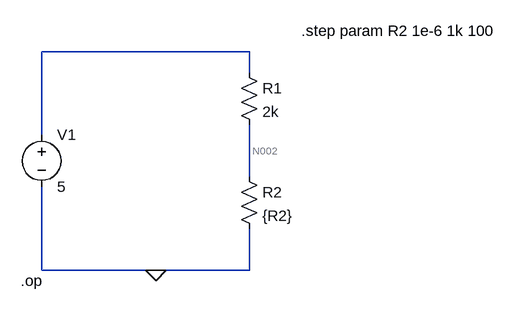
[diagram p0: schematic Draft2.asc]
Draft2.asc, the LTspice schematic file:
Version 4
SHEET 1 880 680
WIRE 320 -352 0 -352
WIRE 320 -320 320 -352
WIRE 0 -224 0 -352
WIRE 320 -160 320 -240
WIRE 0 -16 0 -144
WIRE 176 -16 0 -16
WIRE 320 -16 320 -80
WIRE 320 -16 176 -16
FLAG 176 -16 0
SYMBOL res 304 -336 R0
SYMATTR InstName R1
SYMATTR Value 2k
SYMBOL voltage 0 -240 R0
WINDOW 123 0 0 Left 0
WINDOW 39 0 0 Left 0
SYMATTR InstName V1
SYMATTR Value 5
SYMBOL res 304 -176 R0
SYMATTR InstName R2
SYMATTR Value {R2}
TEXT 400 -384 Left 2 !.step param R2 1e-6 1k 100
TEXT -32 0 Left 2 !.op

The netlist it stands for:
* Draft2.asc
R1 N001 N002 2k
V1 N001 0 5
R2 N002 0 {R2}
.step param R2 1e-6 1k 100
.op
.backanno
.end

* Results of the author's LTspice run, read from the files saved beside the schematic
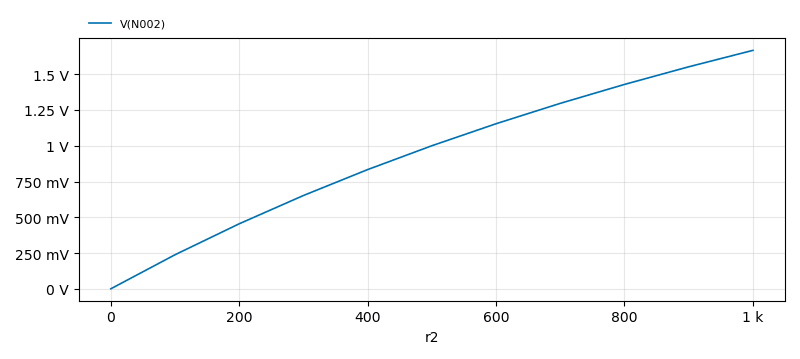
[diagram p1: Operating Point of Draft2.asc, plotted from the saved traces]
* Operating Point, 1 run:
*   V(N002): 2.5 nV at r2=1 µ, 1.667 V at r2=1 k, min 2.5 nV, max 1.667 V